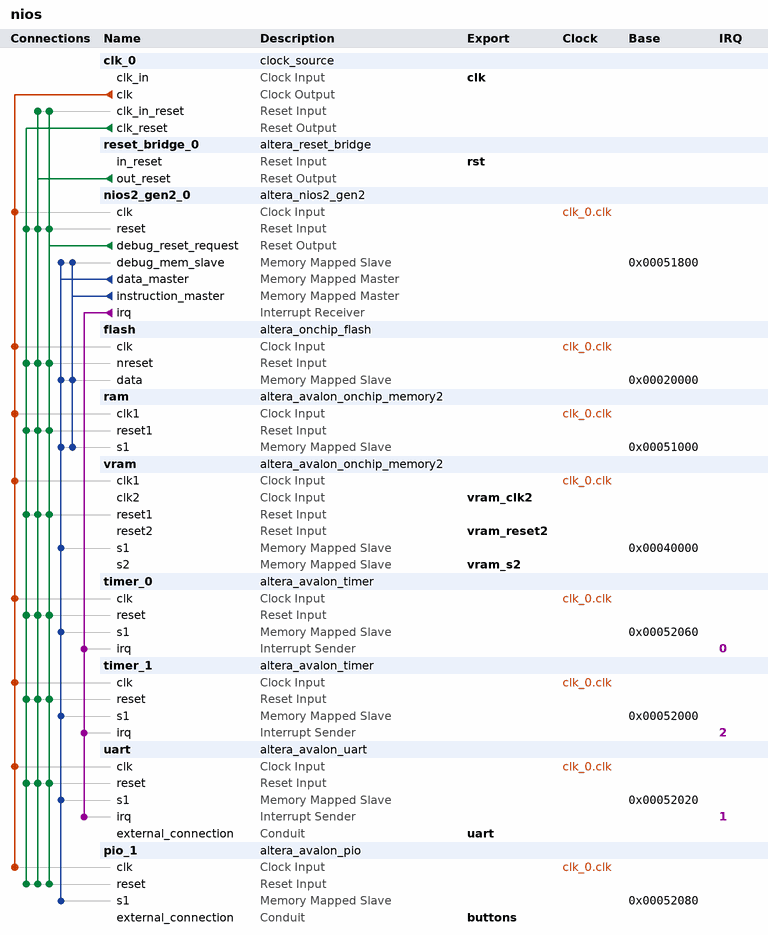
[diagram p0: system contents]
# Platform Designer (Qsys) system nios, MAX 10 10M08DAF256C8GES
# Parameters at their usual value, and those the tool derives, are not listed.
package require -exact qsys 17.0
create_system nios
set_project_property DEVICE_FAMILY {MAX 10}
set_project_property DEVICE 10M08DAF256C8GES

add_instance clk_0 clock_source 17.0
set_instance_parameter_value clk_0 clockFrequency 100000000

add_instance reset_bridge_0 altera_reset_bridge 17.0
set_instance_parameter_value reset_bridge_0 ACTIVE_LOW_RESET 1
set_instance_parameter_value reset_bridge_0 SYNCHRONOUS_EDGES none

add_instance nios2_gen2_0 altera_nios2_gen2 17.0
set_instance_parameter_value nios2_gen2_0 dcache_size 2048
set_instance_parameter_value nios2_gen2_0 exceptionSlave flash.data
set_instance_parameter_value nios2_gen2_0 icache_size 4096
set_instance_parameter_value nios2_gen2_0 impl Tiny
set_instance_parameter_value nios2_gen2_0 resetSlave flash.data

add_instance flash altera_onchip_flash 17.0
set_instance_parameter_value flash CONFIGURATION_MODE {Single Uncompressed Image}
set_instance_parameter_value flash SECTOR_ACCESS_MODE {Read only,Read only,Read only,Hidden,Hidden}
set_instance_parameter_value flash initFlashContent false
set_instance_parameter_value flash initializationFileName altera_onchip_flash.hex
set_instance_parameter_value flash useNonDefaultInitFile false

add_instance ram altera_avalon_onchip_memory2 17.0
set_instance_parameter_value ram dataWidth 32
set_instance_parameter_value ram dualPort false
set_instance_parameter_value ram initMemContent false
set_instance_parameter_value ram initializationFileName onchip_mem.hex
set_instance_parameter_value ram memorySize 2048

add_instance vram altera_avalon_onchip_memory2 17.0
set_instance_parameter_value vram dataWidth 32
set_instance_parameter_value vram dualPort true
set_instance_parameter_value vram initMemContent false
set_instance_parameter_value vram initializationFileName onchip_mem.hex
set_instance_parameter_value vram memorySize 36800
set_instance_parameter_value vram resetrequest_enabled false

add_instance timer_0 altera_avalon_timer 17.0
set_instance_parameter_value timer_0 period 1
set_instance_parameter_value timer_0 periodUnits MSEC

add_instance timer_1 altera_avalon_timer 17.0
set_instance_parameter_value timer_1 period 15
set_instance_parameter_value timer_1 periodUnits MSEC

add_instance uart altera_avalon_uart 17.0
set_instance_parameter_value uart baud 9600
set_instance_parameter_value uart dataBits 8
set_instance_parameter_value uart fixedBaud true
set_instance_parameter_value uart parity NONE
set_instance_parameter_value uart stopBits 1

add_instance pio_1 altera_avalon_pio 17.0
set_instance_parameter_value pio_1 direction Input
set_instance_parameter_value pio_1 width 3

# connections
add_connection clk_0.clk flash.clk clock
add_connection clk_0.clk nios2_gen2_0.clk clock
add_connection clk_0.clk pio_1.clk clock
add_connection clk_0.clk ram.clk1 clock
add_connection clk_0.clk timer_0.clk clock
add_connection clk_0.clk timer_1.clk clock
add_connection clk_0.clk uart.clk clock
add_connection clk_0.clk vram.clk1 clock
add_connection clk_0.clk_reset flash.nreset reset
add_connection clk_0.clk_reset nios2_gen2_0.reset reset
add_connection clk_0.clk_reset pio_1.reset reset
add_connection clk_0.clk_reset ram.reset1 reset
add_connection clk_0.clk_reset timer_0.reset reset
add_connection clk_0.clk_reset timer_1.reset reset
add_connection clk_0.clk_reset uart.reset reset
add_connection clk_0.clk_reset vram.reset1 reset
add_connection nios2_gen2_0.debug_reset_request clk_0.clk_in_reset reset
add_connection nios2_gen2_0.debug_reset_request flash.nreset reset
add_connection nios2_gen2_0.debug_reset_request nios2_gen2_0.reset reset
add_connection nios2_gen2_0.debug_reset_request pio_1.reset reset
add_connection nios2_gen2_0.debug_reset_request ram.reset1 reset
add_connection nios2_gen2_0.debug_reset_request timer_0.reset reset
add_connection nios2_gen2_0.debug_reset_request timer_1.reset reset
add_connection nios2_gen2_0.debug_reset_request uart.reset reset
add_connection nios2_gen2_0.debug_reset_request vram.reset1 reset
add_connection reset_bridge_0.out_reset clk_0.clk_in_reset reset
add_connection reset_bridge_0.out_reset flash.nreset reset
add_connection reset_bridge_0.out_reset nios2_gen2_0.reset reset
add_connection reset_bridge_0.out_reset pio_1.reset reset
add_connection reset_bridge_0.out_reset ram.reset1 reset
add_connection reset_bridge_0.out_reset timer_0.reset reset
add_connection reset_bridge_0.out_reset timer_1.reset reset
add_connection reset_bridge_0.out_reset uart.reset reset
add_connection reset_bridge_0.out_reset vram.reset1 reset
add_connection nios2_gen2_0.data_master flash.data avalon
set_connection_parameter_value nios2_gen2_0.data_master/flash.data baseAddress 0x00020000
add_connection nios2_gen2_0.data_master nios2_gen2_0.debug_mem_slave avalon
set_connection_parameter_value nios2_gen2_0.data_master/nios2_gen2_0.debug_mem_slave baseAddress 0x00051800
add_connection nios2_gen2_0.data_master pio_1.s1 avalon
set_connection_parameter_value nios2_gen2_0.data_master/pio_1.s1 baseAddress 0x00052080
add_connection nios2_gen2_0.data_master ram.s1 avalon
set_connection_parameter_value nios2_gen2_0.data_master/ram.s1 baseAddress 0x00051000
add_connection nios2_gen2_0.data_master timer_0.s1 avalon
set_connection_parameter_value nios2_gen2_0.data_master/timer_0.s1 baseAddress 0x00052060
add_connection nios2_gen2_0.data_master timer_1.s1 avalon
set_connection_parameter_value nios2_gen2_0.data_master/timer_1.s1 baseAddress 0x00052000
add_connection nios2_gen2_0.data_master uart.s1 avalon
set_connection_parameter_value nios2_gen2_0.data_master/uart.s1 baseAddress 0x00052020
add_connection nios2_gen2_0.data_master vram.s1 avalon
set_connection_parameter_value nios2_gen2_0.data_master/vram.s1 baseAddress 0x00040000
add_connection nios2_gen2_0.instruction_master flash.data avalon
set_connection_parameter_value nios2_gen2_0.instruction_master/flash.data baseAddress 0x00020000
add_connection nios2_gen2_0.instruction_master nios2_gen2_0.debug_mem_slave avalon
set_connection_parameter_value nios2_gen2_0.instruction_master/nios2_gen2_0.debug_mem_slave baseAddress 0x00051800
add_connection nios2_gen2_0.instruction_master ram.s1 avalon
set_connection_parameter_value nios2_gen2_0.instruction_master/ram.s1 baseAddress 0x00051000
add_connection nios2_gen2_0.irq timer_0.irq interrupt
set_connection_parameter_value nios2_gen2_0.irq/timer_0.irq irqNumber 0
add_connection nios2_gen2_0.irq timer_1.irq interrupt
set_connection_parameter_value nios2_gen2_0.irq/timer_1.irq irqNumber 2
add_connection nios2_gen2_0.irq uart.irq interrupt
set_connection_parameter_value nios2_gen2_0.irq/uart.irq irqNumber 1

# exported interfaces
add_interface buttons conduit end
set_interface_property buttons EXPORT_OF pio_1.external_connection
add_interface clk clock sink
set_interface_property clk EXPORT_OF clk_0.clk_in
add_interface rst reset sink
set_interface_property rst EXPORT_OF reset_bridge_0.in_reset
add_interface uart conduit end
set_interface_property uart EXPORT_OF uart.external_connection
add_interface vram_clk2 clock sink
set_interface_property vram_clk2 EXPORT_OF vram.clk2
add_interface vram_reset2 reset sink
set_interface_property vram_reset2 EXPORT_OF vram.reset2
add_interface vram_s2 avalon slave
set_interface_property vram_s2 EXPORT_OF vram.s2

set_interconnect_requirement {$system} qsys_mm.clockCrossingAdapter HANDSHAKE
set_interconnect_requirement {$system} qsys_mm.enableEccProtection FALSE
set_interconnect_requirement {$system} qsys_mm.insertDefaultSlave FALSE
set_interconnect_requirement {$system} qsys_mm.maxAdditionalLatency 1

save_system nios.qsys
